# Altium schematic sheet FGPA_Configuration.SchDoc: FPGA Configuration Banks
size B; CheckedBy: Jason Sullins; Author: Jordan Harris-Toovy; Revision: 0.2; SheetNumber: 17; SheetTotal: 22; Size: ANSI B
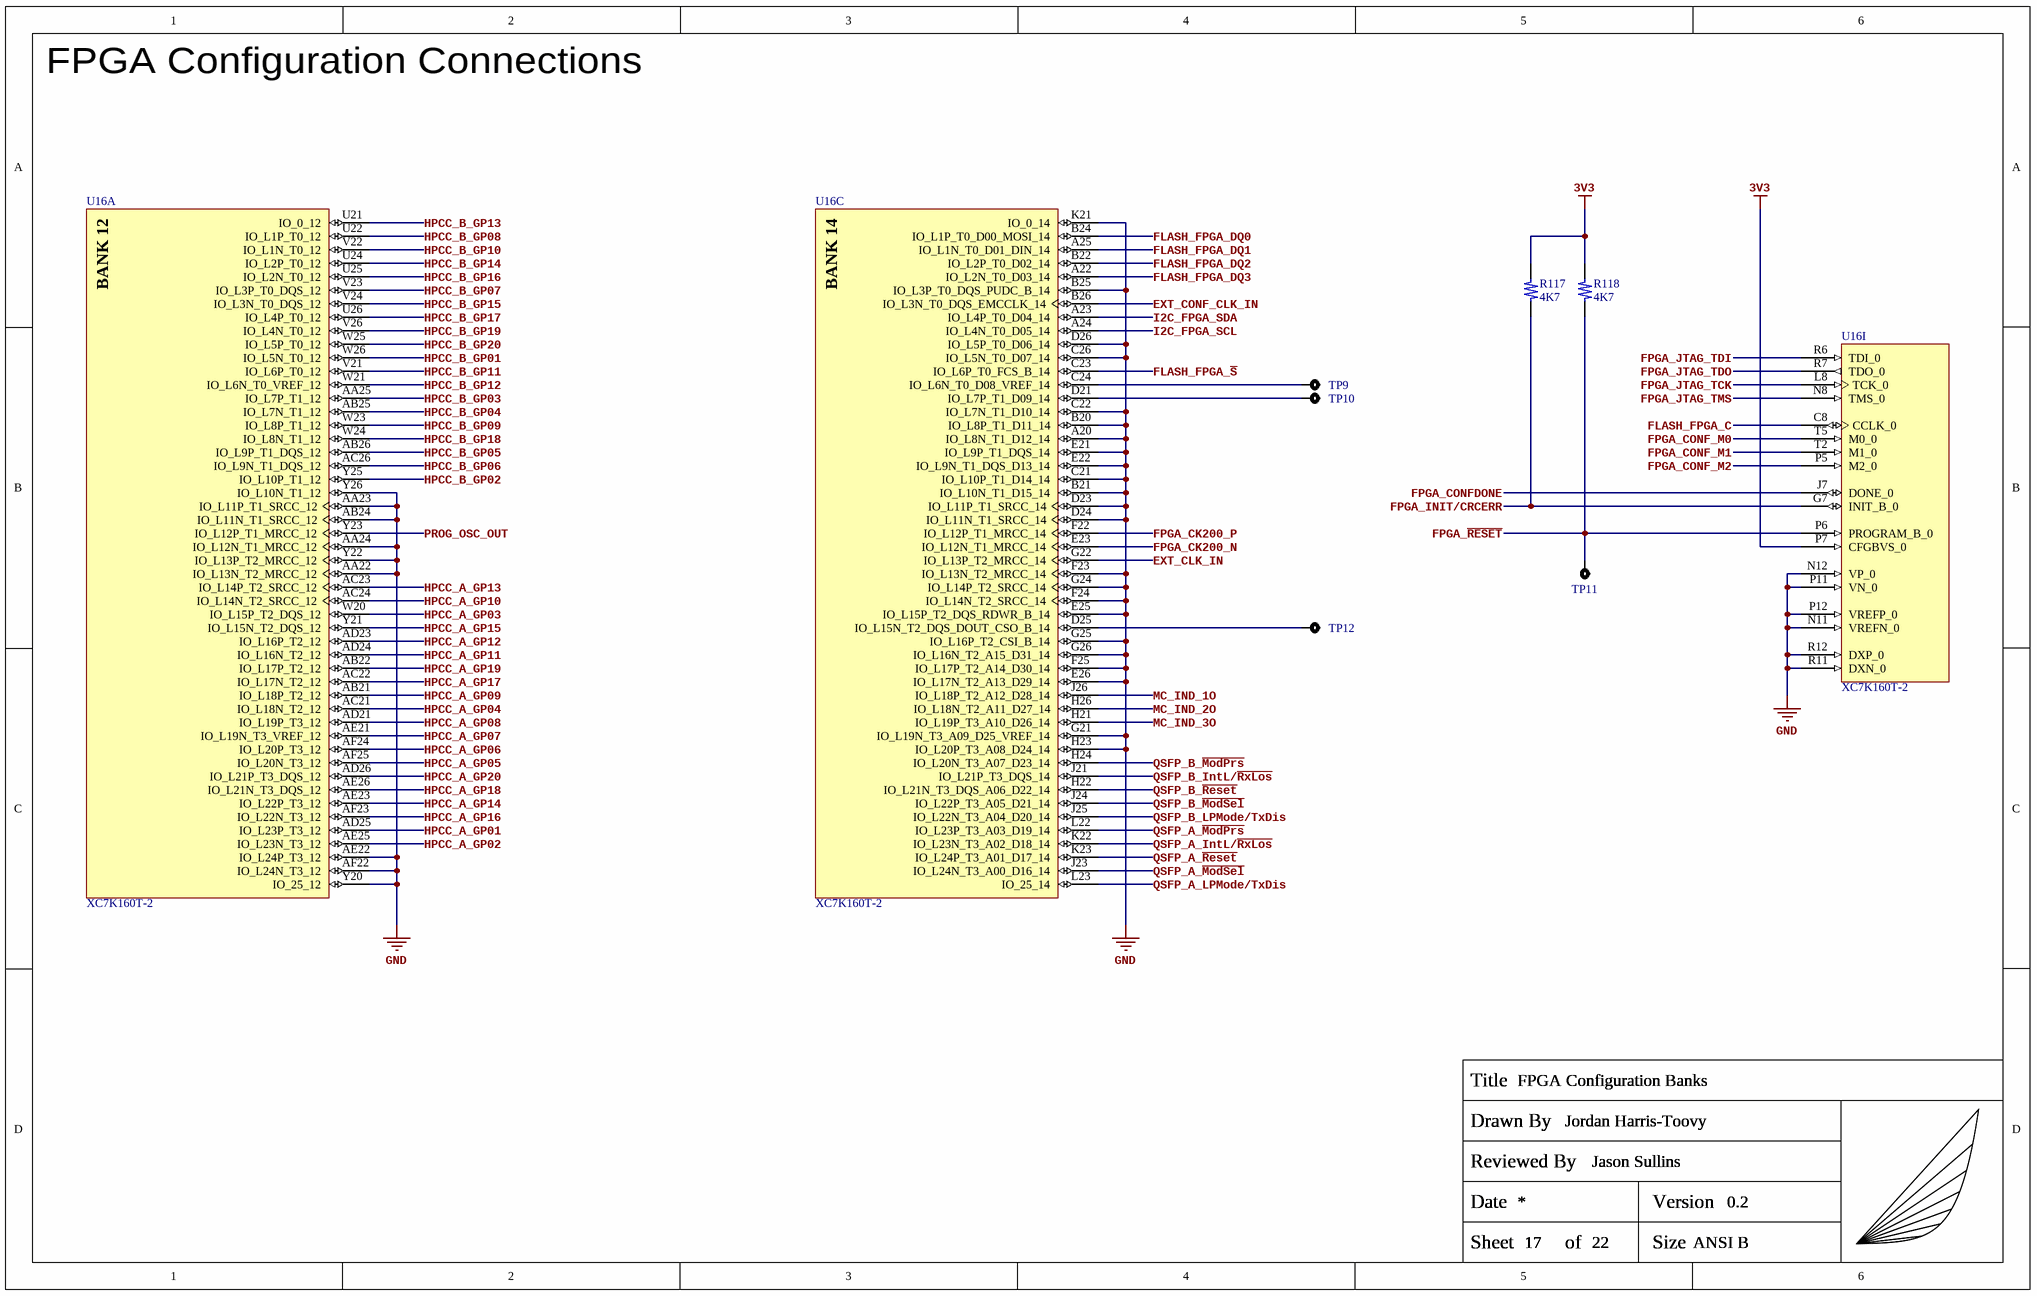
[diagram p0: FGPA_Configuration.SchDoc]

## Parts
R117  4K7  [R_0402_Generic]
R118  4K7  [R_0402_Generic]
TITLEBLOCK?  Capstone_Title_Block  (value not drawn)  (graphical)
TP9  FPGA B14 L6N/VREF Test Point  [TP_3MM]  (value not drawn)
TP10  FPGA B14 L7P Test Point  [TP_3MM]  (value not drawn)
TP11  FPGA nRESET Test Point  [TP_3MM]  (value not drawn)
TP12  FPGA DOUT Test Point  [TP_3MM]  (value not drawn)
U16  XC7K160T-2  [FFG676_(XC7K160T-2FFG676I)]  (parts A,C,I of 14)

## Nets
3V3: R117.2 R118.2 U16.P7(CFGBVS_0)
GND: U16.A20(IO_L8N_T1_D12_14) U16.AA22(IO_L13N_T2_MRCC_12) U16.AA23(IO_L11P_T1_SRCC_12) U16.AA24(IO_L12N_T1_MRCC_12) U16.AB24(IO_L11N_T1_SRCC_12) U16.AE22(IO_L24P_T3_12) U16.AF22(IO_L24N_T3_12) U16.B20(IO_L8P_T1_D11_14) U16.B21(IO_L10N_T1_D15_14) U16.B25(IO_L3P_T0_DQS_PUDC_B_14) U16.C21(IO_L10P_T1_D14_14) U16.C22(IO_L7N_T1_D10_14) U16.C26(IO_L5N_T0_D07_14) U16.D23(IO_L11P_T1_SRCC_14) U16.D24(IO_L11N_T1_SRCC_14) U16.D26(IO_L5P_T0_D06_14) U16.E21(IO_L9P_T1_DQS_14) U16.E22(IO_L9N_T1_DQS_D13_14) U16.E25(IO_L15P_T2_DQS_RDWR_B_14) U16.E26(IO_L17N_T2_A13_D29_14) U16.F23(IO_L13N_T2_MRCC_14) U16.F24(IO_L14N_T2_SRCC_14) U16.F25(IO_L17P_T2_A14_D30_14) U16.G21(IO_L19N_T3_A09_D25_VREF_14) U16.G24(IO_L14P_T2_SRCC_14) U16.G25(IO_L16P_T2_CSI_B_14) U16.G26(IO_L16N_T2_A15_D31_14) U16.H23(IO_L20P_T3_A08_D24_14) U16.K21(IO_0_14) U16.N11(VREFN_0) U16.N12(VP_0) U16.P11(VN_0) U16.P12(VREFP_0) U16.R11(DXN_0) U16.R12(DXP_0) U16.Y20(IO_25_12) U16.Y22(IO_L13P_T2_MRCC_12) U16.Y26(IO_L10N_T1_12)
EXT_CLK_IN: U16.G22(IO_L13P_T2_MRCC_14)
EXT_CONF_CLK_IN: U16.B26(IO_L3N_T0_DQS_EMCCLK_14)
FLASH_FPGA_C: U16.C8(CCLK_0)
FLASH_FPGA_DQ0: U16.B24(IO_L1P_T0_D00_MOSI_14)
FLASH_FPGA_DQ1: U16.A25(IO_L1N_T0_D01_DIN_14)
FLASH_FPGA_DQ2: U16.B22(IO_L2P_T0_D02_14)
FLASH_FPGA_DQ3: U16.A22(IO_L2N_T0_D03_14)
FLASH_FPGA_~{S}: U16.C23(IO_L6P_T0_FCS_B_14)
FPGA_CK200_N: U16.E23(IO_L12N_T1_MRCC_14)
FPGA_CK200_P: U16.F22(IO_L12P_T1_MRCC_14)
FPGA_CONF_M0: U16.T5(M0_0)
FPGA_CONF_M1: U16.T2(M1_0)
FPGA_CONF_M2: U16.P5(M2_0)
FPGA_CONFDONE: U16.J7(DONE_0)
FPGA_INIT/CRCERR: R117.1 U16.G7(INIT_B_0)
FPGA_JTAG_TCK: U16.L8(TCK_0)
FPGA_JTAG_TDI: U16.R6(TDI_0)
FPGA_JTAG_TDO: U16.R7(TDO_0)
FPGA_JTAG_TMS: U16.N8(TMS_0)
FPGA_~{RESET}: R118.1 TP11.1 U16.P6(PROGRAM_B_0)
HPCC_A_GP01: U16.AD25(IO_L23P_T3_12)
HPCC_A_GP02: U16.AE25(IO_L23N_T3_12)
HPCC_A_GP03: U16.W20(IO_L15P_T2_DQS_12)
HPCC_A_GP04: U16.AC21(IO_L18N_T2_12)
HPCC_A_GP05: U16.AF25(IO_L20N_T3_12)
HPCC_A_GP06: U16.AF24(IO_L20P_T3_12)
HPCC_A_GP07: U16.AE21(IO_L19N_T3_VREF_12)
HPCC_A_GP08: U16.AD21(IO_L19P_T3_12)
HPCC_A_GP09: U16.AB21(IO_L18P_T2_12)
HPCC_A_GP10: U16.AC24(IO_L14N_T2_SRCC_12)
HPCC_A_GP11: U16.AD24(IO_L16N_T2_12)
HPCC_A_GP12: U16.AD23(IO_L16P_T2_12)
HPCC_A_GP13: U16.AC23(IO_L14P_T2_SRCC_12)
HPCC_A_GP14: U16.AE23(IO_L22P_T3_12)
HPCC_A_GP15: U16.Y21(IO_L15N_T2_DQS_12)
HPCC_A_GP16: U16.AF23(IO_L22N_T3_12)
HPCC_A_GP17: U16.AC22(IO_L17N_T2_12)
HPCC_A_GP18: U16.AE26(IO_L21N_T3_DQS_12)
HPCC_A_GP19: U16.AB22(IO_L17P_T2_12)
HPCC_A_GP20: U16.AD26(IO_L21P_T3_DQS_12)
HPCC_B_GP01: U16.W26(IO_L5N_T0_12)
HPCC_B_GP02: U16.Y25(IO_L10P_T1_12)
HPCC_B_GP03: U16.AA25(IO_L7P_T1_12)
HPCC_B_GP04: U16.AB25(IO_L7N_T1_12)
HPCC_B_GP05: U16.AB26(IO_L9P_T1_DQS_12)
HPCC_B_GP06: U16.AC26(IO_L9N_T1_DQS_12)
HPCC_B_GP07: U16.V23(IO_L3P_T0_DQS_12)
HPCC_B_GP08: U16.U22(IO_L1P_T0_12)
HPCC_B_GP09: U16.W23(IO_L8P_T1_12)
HPCC_B_GP10: U16.V22(IO_L1N_T0_12)
HPCC_B_GP11: U16.V21(IO_L6P_T0_12)
HPCC_B_GP12: U16.W21(IO_L6N_T0_VREF_12)
HPCC_B_GP13: U16.U21(IO_0_12)
HPCC_B_GP14: U16.U24(IO_L2P_T0_12)
HPCC_B_GP15: U16.V24(IO_L3N_T0_DQS_12)
HPCC_B_GP16: U16.U25(IO_L2N_T0_12)
HPCC_B_GP17: U16.U26(IO_L4P_T0_12)
HPCC_B_GP18: U16.W24(IO_L8N_T1_12)
HPCC_B_GP19: U16.V26(IO_L4N_T0_12)
HPCC_B_GP20: U16.W25(IO_L5P_T0_12)
I2C_FPGA_SCL: U16.A24(IO_L4N_T0_D05_14)
I2C_FPGA_SDA: U16.A23(IO_L4P_T0_D04_14)
MC_IND_1O: U16.J26(IO_L18P_T2_A12_D28_14)
MC_IND_2O: U16.H26(IO_L18N_T2_A11_D27_14)
MC_IND_3O: U16.H21(IO_L19P_T3_A10_D26_14)
PROG_OSC_OUT: U16.Y23(IO_L12P_T1_MRCC_12)
QSFP_A_IntL/~{RxLos}: U16.K22(IO_L23N_T3_A02_D18_14)
QSFP_A_LPMode/TxDis: U16.L23(IO_25_14)
QSFP_A_~{ModPrs}: U16.L22(IO_L23P_T3_A03_D19_14)
QSFP_A_~{ModSel}: U16.J23(IO_L24N_T3_A00_D16_14)
QSFP_A_~{Reset}: U16.K23(IO_L24P_T3_A01_D17_14)
QSFP_B_IntL/~{RxLos}: U16.J21(IO_L21P_T3_DQS_14)
QSFP_B_LPMode/TxDis: U16.J25(IO_L22N_T3_A04_D20_14)
QSFP_B_~{ModPrs}: U16.H24(IO_L20N_T3_A07_D23_14)
QSFP_B_~{ModSel}: U16.J24(IO_L22P_T3_A05_D21_14)
QSFP_B_~{Reset}: U16.H22(IO_L21N_T3_DQS_A06_D22_14)
NetTP9_1: TP9.1 U16.C24(IO_L6N_T0_D08_VREF_14)
NetTP10_1: TP10.1 U16.D21(IO_L7P_T1_D09_14)
NetTP12_1: TP12.1 U16.D25(IO_L15N_T2_DQS_DOUT_CSO_B_14)

## Notes on the sheet
- FPGA Configuration Connections
- (in symbol Capstone_Title_Block) Title; Drawn By; Reviewed By; Date; Version; Sheet; of; Size
- (in symbol XC7K160T-2FFG676I, part A) BANK 12
- (in symbol XC7K160T-2FFG676I, part C) BANK 14

## Library data of the parts
R117 R118 = ERJ-2RKF4701X: 4.7KOhm 1% 1/10W SMD resistor in 0402 size; Manufacturer: Panasonic; Manufacturer Part Number: ERJ-2RKF4701X
TITLEBLOCK? = Capstone_Title_Block: Custom title block with personal logo; Manufacturer: NONE; Manufacturer Part Number: NONE
TP9-TP12 = SMD Test Point: SMD Test point 3mm circle; Manufacturer: NONE; Manufacturer Part Number: NONE
U16 = XC7K160T-2FFG676I: Kintex-7 FPGA, 400 User I/Os, 8 GTX, 676-Ball BGA, Speed Grade 2, Industrial Grade, Pb-Free; Manufacturer: AMD/Xilinx; Manufacturer Part Number: XC7K160T-2FFG676I